# EAGLE design train gate (EAGLE 6.5.0)
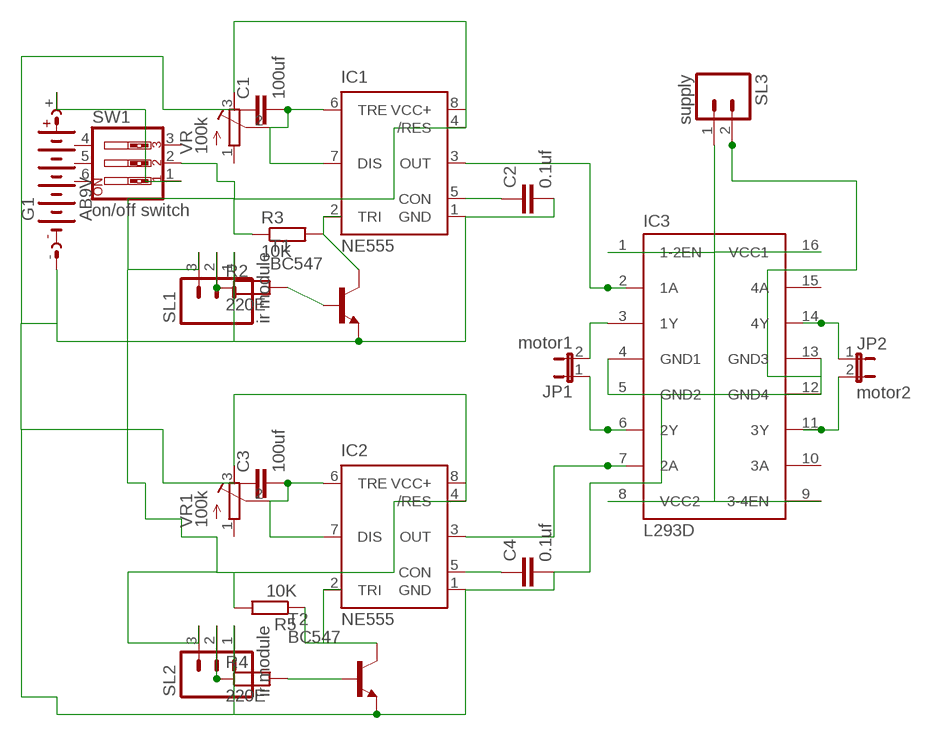
[diagram p0: schematic, sheet 1]

## Parts
C1  100uf  C5/7.2  [C5B7.2]
C2  0.1uf  C2,5-3  [C2.5-3]
C3  100uf  C5/7.2  [C5B7.2]
C4  0.1uf  C2,5-3  [C2.5-3]
G1  AB9V  [AB9V]
IC1  NE555  [DIL-08]
IC2  NE555  [DIL-08]
IC3  L293D  [DIL16]
JP1  motor1  JP1E  [JP1]
JP2  motor2  JP1E  [JP1]
R2  220E  R-EU_0204/7  [0204/7]
R3  10K  R-EU_0204/7  [0204/7]
R4  220E  R-EU_0204/7  [0204/7]
R5  10K  R-EU_0204/7  [0204/7]
SL1  ir module  M03  [03P]
SL2  ir module  M03  [03P]
SL3  supply  M02  [02P]
SW1  on/off switch  SW_DIP-3  [EDG-03]
T1  BC547  [TO92]
T2  BC547  [TO92]
VR  100k  R-TRIMM64P  [RTRIM64P]
VR1  100k  R-TRIMM64P  [RTRIM64P]

## Nets
N$1: C1.2 IC1.6(TRE) IC1.7(DIS) VR.2(S)
N$2: C3.2 IC2.6(TRE) IC2.7(DIS) VR1.2(S)
N$3: R2.1 SL1.2
N$4: R4.1 SL2.2
N$5: C2.1 IC1.5(CON)
N$7: R4.2 T2.2(B)
N$8: G1.+ SW1.1
N$9: IC1.2(TRI) R3.2 T1.3(C)
N$10: C4.1 IC2.5(CON)
N$11: IC2.2(TRI) R5.1 T2.3(C)
N$12: C1.1 C2.2 C3.1 C4.2 G1.- IC1.1(GND) IC2.1(GND) IC3.4(GND1) IC3.5(GND2) IC3.12(GND4) IC3.13(GND3) SL1.1 SL2.1 SL3.2 T1.1(E) T2.1(E)
N$13: IC3.1(1-2EN) IC3.8(VCC2) IC3.9(3-4EN) IC3.16(VCC1) SL3.1
N$14: IC1.4(/RES) IC1.8(VCC+) IC2.4(/RES) IC2.8(VCC+) R3.1 R5.2 SL1.3 SL2.3 SW1.2 VR1.3(A) VR.3(A)
N$16: R2.2 T1.2(B)
N$17: IC3.3(1Y) JP1.2
N$18: IC3.6(2Y) JP1.1
N$19: IC3.14(4Y) JP2.1
N$20: IC3.11(3Y) JP2.2
N$21: IC1.3(OUT) IC3.2(1A)
N$22: IC2.3(OUT) IC3.7(2A)
Unconnected: IC3.10(3A) IC3.15(4A) SW1.3 SW1.4 SW1.5 SW1.6 VR1.1(E) VR.1(E)

## Library data of the parts
C1-C4 = capacitor-wima:C: CAPACITOR naming: grid - package width
G1 = battery:AB9V: 9-V BATTERY CLIP
IC1 IC2 = st-microelectronics:NE555: General purpose bipolar Timer; MF: Arrow Electronics; MPN: NE555N; OC_FARNELL: 1467742; OC_NEWARK: 89K1486
IC3 = st-microelectronics:L293D: PUSH-PULL 4 CHANNEL DRIVER; MPN: L293D; OC_FARNELL: 9589619; OC_NEWARK: 56P8249
JP1 JP2 = jumper:JP1E: JUMPER
R2-R5 = rcl:R-EU_: RESISTOR, European symbol
SL1 SL2 = con-amp-quick:M03: AMP QUICK CONNECTOR; OC_FARNELL: unknown; OC_NEWARK: unknown
SL3 = con-amp-quick:M02: AMP QUICK CONNECTOR; OC_FARNELL: unknown; OC_NEWARK: unknown
SW1 = special:SW_DIP-3: DIP SWITCH
T1 T2 = transistor:BC547: NPN TRANSISTOR
VR VR1 = resistor:R-TRIMM: Trimm resistor

## Board
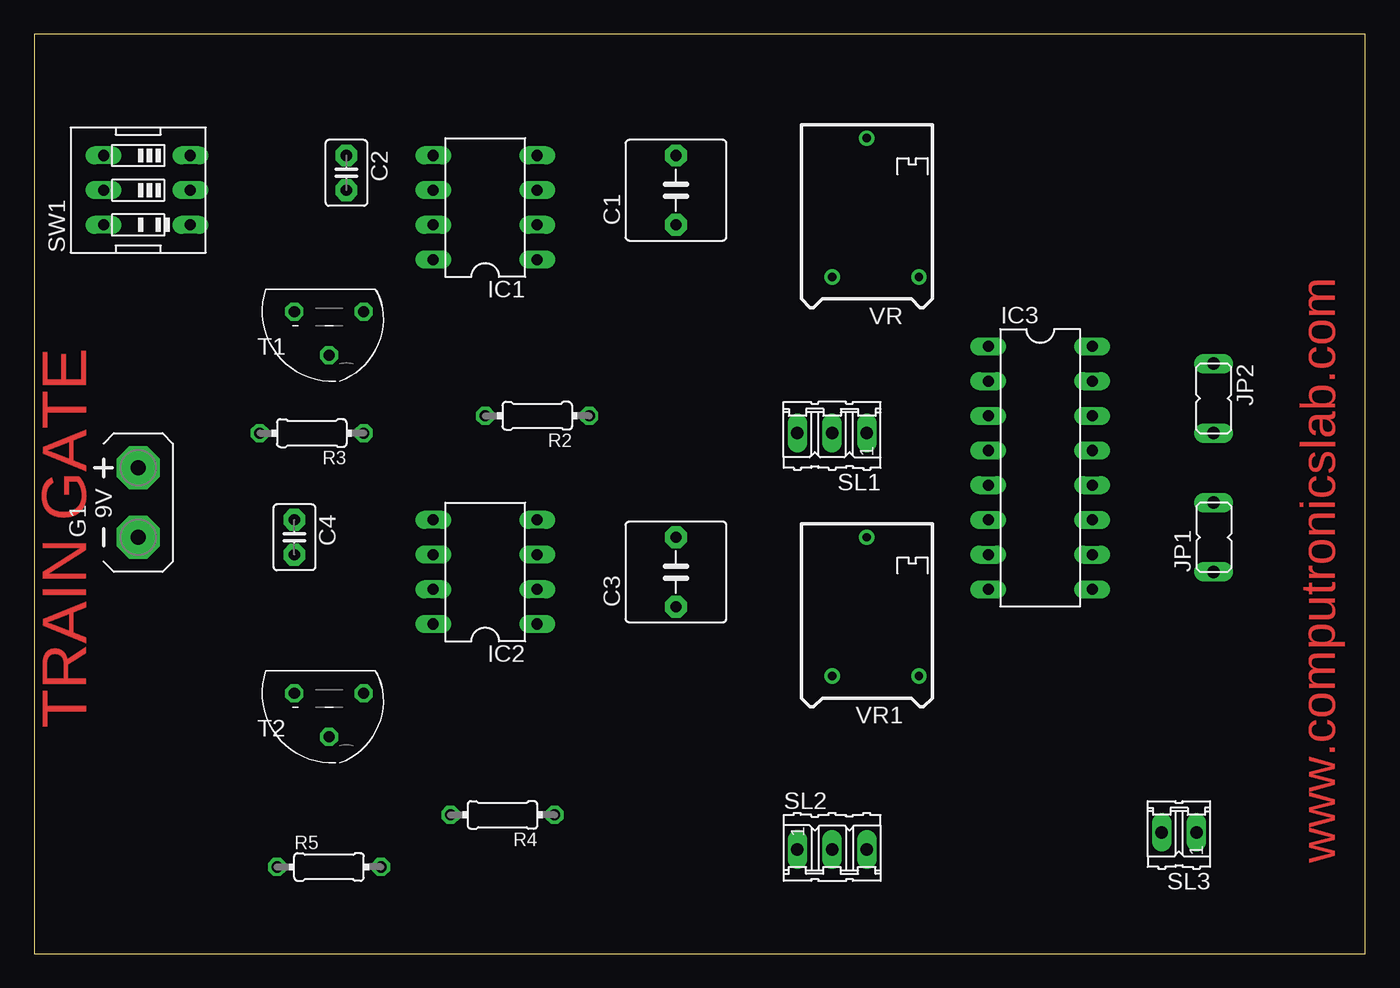
[diagram p1: board, top side]
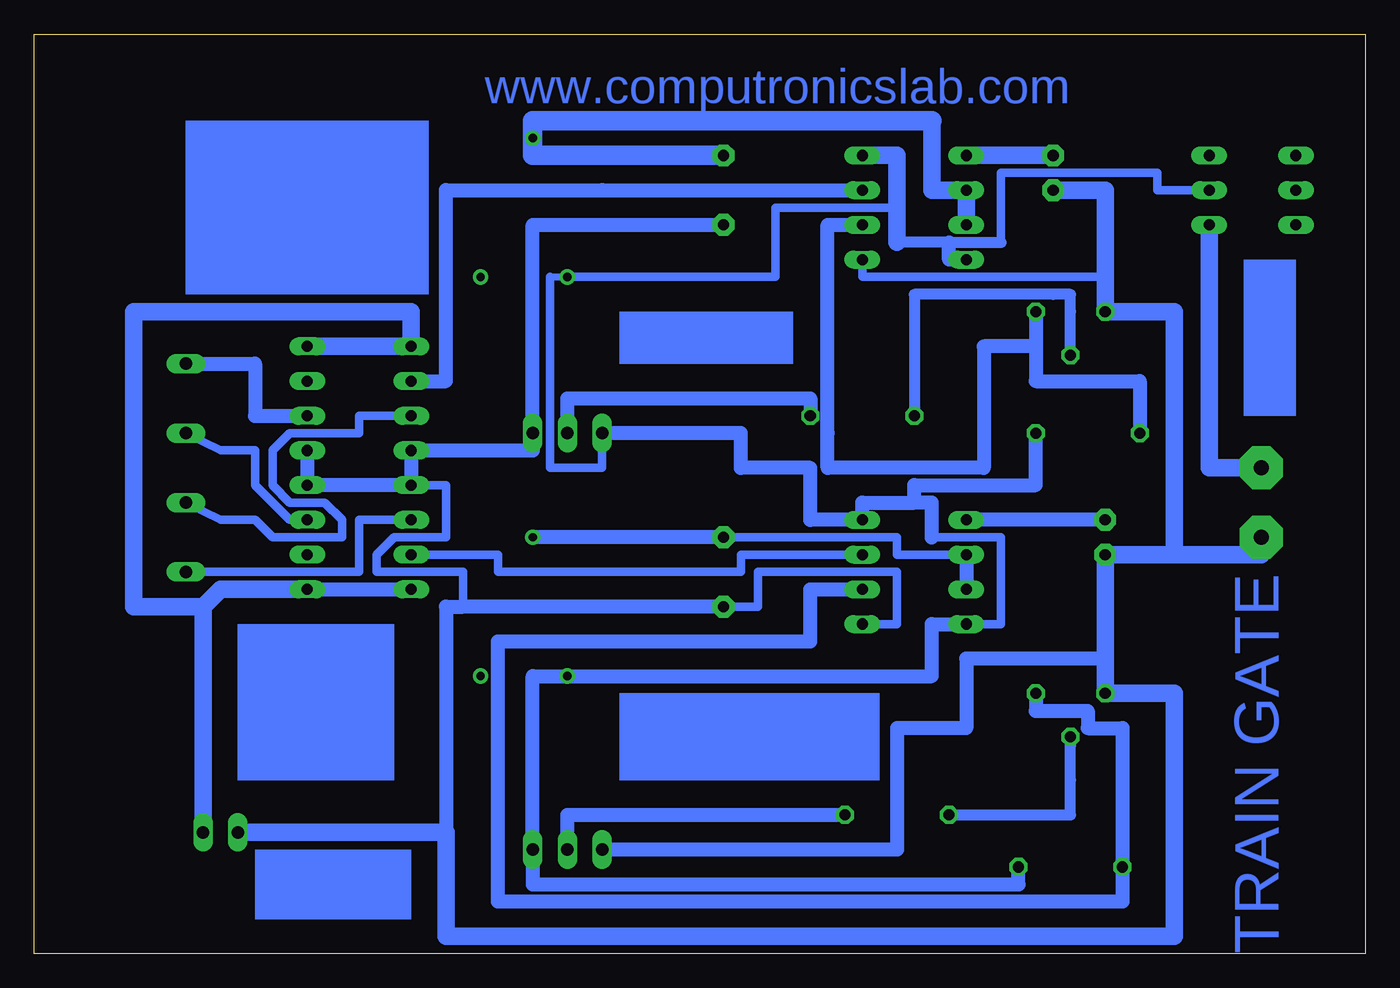
[diagram p2: board, bottom side, seen from below]

Size 97.46 x 67.3 mm. Coordinates in mm from the lower left corner, seen from the top.
Outline: 0,0 97.46,0 97.46,67.3 0,67.3 0,0
Copper layers (1*16): Top 0.035mm / dielectric 1.5mm / Bottom 0.035mm
Design rules "default *": minimum track width 20mil, minimum drill 24mil, track to track 8mil, track to pad 8mil, pad to pad 8mil, via to via 8mil, smd to smd 8mil, copper to edge 40mil, drill to drill 8mil, minimum pad ring 10mil, minimum via ring 8mil, stop-mask expansion 4mil, vias tented up to drill 0mil, thermal gap 10mil

### Footprints (pad centres in the part's own frame; a part is rotated, then mirrored left to right if it is on the bottom)
C5B7.2 = drill 0.813 pad 1.6 octagon: 1 -2.54,0; 2 2.54,0
C2.5-3 = drill 0.813 pad 1.6 octagon: 1 -1.27,0; 2 1.27,0
AB9V = drill 1.118 pad 3.15 octagon: + 0,2.54; - 0,-2.54
DIL-08 = drill 0.813 long: 1 -3.81,-3.81; 2 -1.27,-3.81; 3 1.27,-3.81; 4 3.81,-3.81; 5 3.81,3.81; 6 1.27,3.81; 7 -1.27,3.81; 8 -3.81,3.81
DIL16 = drill 0.813 long: 1 -8.89,-3.81; 2 -6.35,-3.81; 3 -3.81,-3.81; 4 -1.27,-3.81; 5 1.27,-3.81; 6 3.81,-3.81; 7 6.35,-3.81; 8 8.89,-3.81; 9 8.89,3.81; 10 6.35,3.81; 11 3.81,3.81; 12 1.27,3.81; 13 -1.27,3.81; 14 -3.81,3.81; 15 -6.35,3.81; 16 -8.89,3.81
JP1 = drill 0.914 long: 1 0,-2.54; 2 0,2.54
0204/7 = drill 0.813 octagon: 1 -3.81,0; 2 3.81,0
03P = drill 0.914 long: 1 -2.54,0; 2 0,0; 3 2.54,0
02P = drill 0.914 long: 1 -1.27,0; 2 1.27,0
EDG-03 = drill 0.813 long: 1 -2.54,-3.81; 2 0,-3.81; 3 2.54,-3.81; 4 2.54,2.54; 5 0,2.54; 6 -2.54,2.54
TO92 = drill 0.813 octagon: 1 2.54,-1.27; 2 0,1.905; 3 -2.54,-1.27
RTRIM64P = drill 0.61: 1 -2.54,-3.81; 2 7.62,0; 3 -2.54,2.54

### Placement (x,y rotation side)
C1  46.99,55.88 90 top
C2  22.86,57.15 270 top
C3  46.99,27.94 90 top
C4  19.05,30.48 270 top
G1  7.62,33.02 0 top
IC1  33.02,54.61 90 top
IC2  33.02,27.94 90 top
IC3  73.66,35.56 270 top
JP1  86.36,30.48 0 top
JP2  86.36,40.64 180 top
R2  36.83,39.37 180 top
R3  20.32,38.1 180 top
R4  34.29,10.16 180 top
R5  21.59,6.35 0 top
SL1  58.42,38.1 180 top
SL2  58.42,7.62 0 top
SL3  83.82,8.89 180 top
SW1  7.62,55.88 90 top
T1  21.59,45.72 180 top
T2  21.59,17.78 180 top
VR  60.96,52.07 90 top
VR1  60.96,22.86 90 top

### Tracks (layer width: path | path; a pad name or v marks a point on that pad's centre or on a via)
N$1
  Bottom 1.27: IC1.7 IC1.6 31.75,55.88 31.75,60.96
  Bottom 1.422: C1.2 60.96,58.42 VR.2 60.96,60.96 31.75,60.96
N$2
  Bottom 0.61: IC2.6 34.29,29.21 34.29,30.48 C3.2
  Bottom 1.016: IC2.6 IC2.7 | C3.2 VR1.2
N$3
  Bottom 1.016: R2.1 40.64,40.64 58.42,40.64 SL1.2
N$4
  Bottom 1.016: R4.1 55.88,10.16 58.42,10.16 SL2.2
N$5
  Bottom 1.27: C2.1 IC1.5
N$7
  Bottom 0.813: R4.2 26.67,10.16 21.59,10.16 21.59,12.7 21.59,15.24 T2.2
N$8
  Bottom 1.27: SW1.1 11.43,35.56 G1.+
N$9
  Bottom 1.016: R3.2 16.51,41.91 24.13,41.91 24.13,44.45 | T1.3 24.13,44.45 | IC1.2 39.37,53.34 39.37,38.1 39.37,35.56 27.94,35.56 27.94,44.45 24.13,44.45
N$10
  Bottom 1.016: C4.1 IC2.5
N$11
  Bottom 1.016: T2.3 24.13,17.78 20.32,17.78 20.32,16.51 17.78,16.51 R5.1 17.78,3.81 63.5,3.81 63.5,22.86 40.64,22.86 40.64,26.67 IC2.2
N$12
  Bottom 0.61: IC2.1 34.29,24.13 34.29,27.94 44.45,27.94 44.45,25.4 C3.1 | IC3.5 67.31,34.29 67.31,30.48 71.12,30.48 72.39,29.21 72.39,27.94 66.04,27.94 66.04,25.4 | IC1.1 36.83,49.53 19.05,49.53
  Bottom 1.016: IC3.13 IC3.12 IC3.5 IC3.4 60.96,36.83 SL1.1 60.96,53.34 C1.1 | 67.31,8.89 67.31,25.4 66.04,25.4 C3.1 | SL2.1 34.29,7.62 34.29,8.89 34.29,16.51 29.21,16.51 29.21,21.59 19.05,21.59
  Bottom 1.27: SL3.2 67.31,8.89 67.31,1.27 13.97,1.27 13.97,19.05 T2.1 19.05,21.59 C4.2 13.97,29.21 | C2.2 19.05,55.88 19.05,49.53 T1.1 13.97,46.99 13.97,29.21 | G1.- 7.62,29.21 13.97,29.21
N$13
  Bottom 1.016: IC3.9 IC3.8
  Bottom 1.27: 85.09,25.4 SL3.1 | IC3.9 83.82,26.67 85.09,25.4 | IC3.16 IC3.1 69.85,46.99 90.17,46.99 90.17,25.4 85.09,25.4
N$14
  Bottom 0.508: 59.69,49.53 VR.3
  Bottom 0.61: VR.3 43.18,49.53 43.18,54.61 34.29,54.61 | SW1.2 15.24,55.88 15.24,57.15 26.67,57.15 26.67,52.07 | SL1.3 55.88,35.56 59.69,35.56 59.69,49.53 | 31.75,30.48 26.67,30.48 26.67,24.13 IC2.8
  Bottom 0.813: IC1.8 30.48,50.8 | 34.29,52.07 30.48,52.07 26.67,52.07
  Bottom 1.016: 30.48,50.8 30.48,52.07 | 33.02,33.02 31.75,33.02 31.75,30.48 | 33.02,33.02 33.02,34.29 24.13,34.29 R3.1 | 33.02,33.02 36.83,33.02 IC2.4 40.64,31.75 40.64,35.56 45.72,35.56 45.72,38.1 SL1.3 | R5.2 25.4,5.08 60.96,5.08 SL2.3 60.96,20.32 VR1.3 31.75,20.32 31.75,24.13 IC2.8
  Bottom 1.27: 34.29,52.07 34.29,54.61 34.29,58.42 IC1.4
N$16
  Bottom 0.813: R2.2 33.02,48.26 22.86,48.26 21.59,48.26 21.59,46.99 T1.2
N$17
  Bottom 0.61: IC3.3 73.66,39.37 73.66,38.1 78.74,38.1 80.01,36.83 80.01,34.29 78.74,33.02 76.2,33.02 74.93,31.75 74.93,30.48 80.01,30.48 81.28,31.75 83.82,31.75 JP1.2
N$18
  Bottom 0.61: IC3.6 73.66,31.75 73.66,27.94 JP1.1
N$19
  Bottom 1.016: IC3.14 81.28,39.37 81.28,43.18 JP2.1
N$20
  Bottom 0.61: IC3.11 78.74,31.75 81.28,34.29 81.28,36.83 83.82,36.83 JP2.2
N$21
  Bottom 1.016: IC1.3 55.88,55.88 67.31,55.88 67.31,41.91 IC3.2
N$22
  Bottom 0.61: IC3.7 63.5,29.21 63.5,27.94 45.72,27.94 45.72,29.21 IC2.3
(copper drawn outside any net)
  shapes: Bottom area x6

### Text on the board
Top: www.computronicslab.com | TRAIN GATE
Bottom: www.computronicslab.com | TRAIN GATE